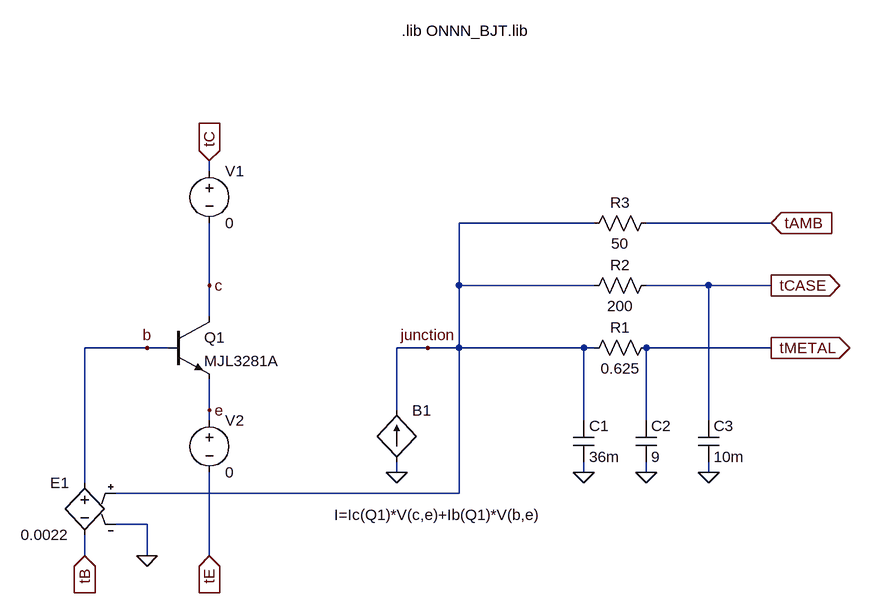
[diagram p0: schematic Thermal2P.asc]
Thermal2P.asc, the LTspice schematic file:
Version 4
SHEET 1 1244 680
WIRE 128 -240 128 -256
WIRE 720 -160 512 -160
WIRE 992 -160 800 -160
WIRE 128 -64 128 -160
WIRE 512 -64 512 -160
WIRE 720 -64 512 -64
WIRE 896 -64 800 -64
WIRE 992 -64 896 -64
WIRE 128 -16 128 -64
WIRE 32 32 -64 32
WIRE 64 32 32 32
WIRE 464 32 416 32
WIRE 512 32 512 -64
WIRE 512 32 464 32
WIRE 704 32 512 32
WIRE 720 32 704 32
WIRE 992 32 800 32
WIRE 128 128 128 80
WIRE 416 128 416 32
WIRE 128 144 128 128
WIRE 704 144 704 32
WIRE 800 144 800 32
WIRE 896 144 896 -64
WIRE 416 224 416 208
WIRE 704 224 704 208
WIRE 800 224 800 208
WIRE 896 224 896 208
WIRE -64 240 -64 32
WIRE 512 256 512 32
WIRE 512 256 -16 256
WIRE 32 304 -16 304
WIRE -64 352 -64 320
WIRE 32 352 32 304
WIRE 128 352 128 224
FLAG 416 224 0
FLAG 128 -64 c
FLAG 32 32 b
FLAG 128 128 e
FLAG 128 -256 tC
IOPIN 128 -256 In
FLAG 464 32 junction
FLAG -64 352 tB
IOPIN -64 352 In
FLAG 32 352 0
FLAG 128 352 tE
IOPIN 128 352 In
FLAG 704 224 0
FLAG 800 224 0
FLAG 992 32 tMETAL
IOPIN 992 32 Out
FLAG 992 -64 tCASE
IOPIN 992 -64 Out
FLAG 896 224 0
FLAG 992 -160 tAMB
IOPIN 992 -160 In
SYMBOL npn 64 -16 R0
SYMATTR InstName Q1
SYMATTR Value MJL3281A
SYMBOL bi2 416 128 R0
WINDOW 3 -96 161 Left 0
SYMATTR Value I=Ic(Q1)*V(c,e)+Ib(Q1)*V(b,e)
SYMATTR InstName B1
SYMBOL voltage 128 -256 R0
WINDOW 123 0 0 Left 0
WINDOW 39 0 0 Left 0
SYMATTR InstName V1
SYMATTR Value 0
SYMBOL e -64 224 M0
SYMATTR InstName E1
SYMATTR Value 0.0022
SYMBOL voltage 128 128 R0
WINDOW 123 0 0 Left 0
WINDOW 39 0 0 Left 0
SYMATTR InstName V2
SYMATTR Value 0
SYMBOL cap 688 144 R0
SYMATTR InstName C1
SYMATTR Value 36m
SYMBOL res 816 16 R90
WINDOW 0 0 56 VBottom 0
WINDOW 3 32 56 VTop 0
SYMATTR InstName R1
SYMATTR Value 0.625
SYMBOL cap 784 144 R0
SYMATTR InstName C2
SYMATTR Value 9
SYMBOL cap 880 144 R0
SYMATTR InstName C3
SYMATTR Value 10m
SYMBOL res 816 -80 R90
WINDOW 0 0 56 VBottom 0
WINDOW 3 32 56 VTop 0
SYMATTR InstName R2
SYMATTR Value 200
SYMBOL res 816 -176 R90
WINDOW 0 0 56 VBottom 0
WINDOW 3 32 56 VTop 0
SYMATTR InstName R3
SYMATTR Value 50
TEXT 424 -456 Left 0 !.lib ONNN_BJT.lib

The netlist it stands for:
* Thermal2P.asc
Q1 c b e 0 MJL3281A
B1 0 junction I=Ic(Q1)*V(c,e)+Ib(Q1)*V(b,e)
V1 tC c 0
E1 b tB junction 0 0.0022
V2 e tE 0
C1 junction 0 36m
R1 tMETAL junction 0.625
C2 tMETAL 0 9
C3 tCASE 0 10m
R2 tCASE junction 200
R3 tAMB junction 50
.model NPN NPN
.model PNP PNP
.lib standard.bjt
.lib ONNN_BJT.lib
.backanno
.end